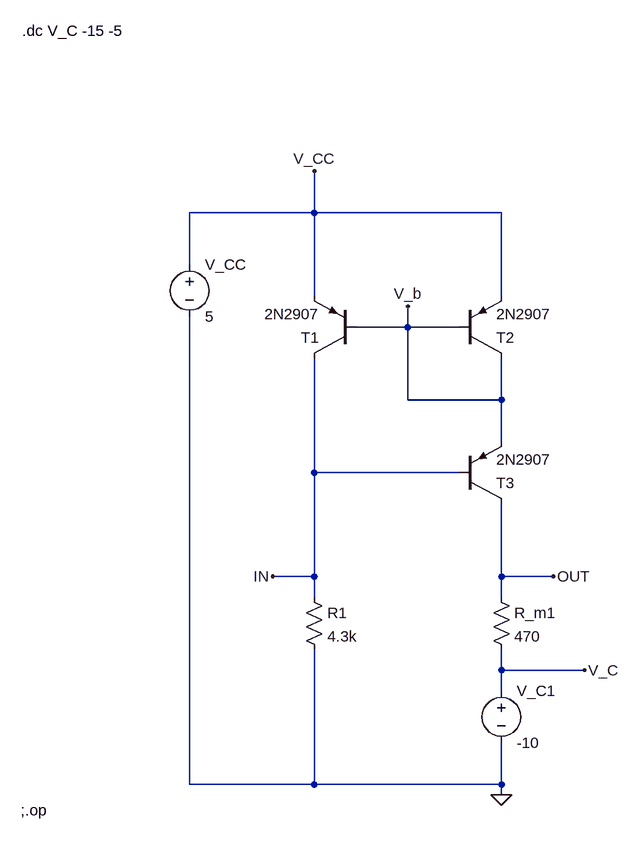
[diagram p0: schematic wilson_current_mirror.asc]
wilson_current_mirror.asc, the LTspice schematic file:
Version 4
SHEET 1 880 680
WIRE -912 -1040 -912 -1104
WIRE -912 -1040 -1104 -1040
WIRE -624 -1040 -912 -1040
WIRE -1104 -960 -1104 -1040
WIRE -912 -912 -912 -1040
WIRE -624 -912 -624 -1040
WIRE -768 -864 -768 -896
WIRE -768 -864 -848 -864
WIRE -688 -864 -768 -864
WIRE -768 -752 -768 -864
WIRE -624 -752 -624 -816
WIRE -624 -752 -768 -752
WIRE -624 -688 -624 -752
WIRE -912 -640 -912 -816
WIRE -688 -640 -912 -640
WIRE -912 -480 -912 -640
WIRE -912 -480 -976 -480
WIRE -624 -480 -624 -592
WIRE -544 -480 -624 -480
WIRE -912 -448 -912 -480
WIRE -624 -448 -624 -480
WIRE -624 -336 -624 -368
WIRE -496 -336 -624 -336
WIRE -624 -304 -624 -336
WIRE -1104 -160 -1104 -880
WIRE -912 -160 -912 -368
WIRE -912 -160 -1104 -160
WIRE -624 -160 -624 -224
WIRE -624 -160 -912 -160
WIRE -624 -144 -624 -160
FLAG -624 -144 0
FLAG -912 -1104 V_CC
FLAG -768 -896 V_b
FLAG -976 -480 IN
FLAG -544 -480 OUT
FLAG -496 -336 V_C
SYMBOL voltage -1104 -976 R0
WINDOW 123 0 0 Left 0
WINDOW 39 0 0 Left 0
SYMATTR InstName V_CC
SYMATTR Value 5
SYMBOL voltage -624 -320 R0
WINDOW 123 0 0 Left 0
WINDOW 39 0 0 Left 0
SYMATTR InstName V_C1
SYMATTR Value -10
SYMBOL pnp -848 -816 R180
SYMATTR InstName T1
SYMATTR Value 2N2907
SYMBOL pnp -688 -816 M180
SYMATTR InstName T2
SYMATTR Value 2N2907
SYMBOL res -928 -464 R0
SYMATTR InstName R1
SYMATTR Value 4.3k
SYMBOL res -640 -464 R0
SYMATTR InstName R_m1
SYMATTR Value 470
SYMBOL pnp -688 -592 M180
SYMATTR InstName T3
SYMATTR Value 2N2907
TEXT -1362 -1320 Left 2 !.dc V_C -15 -5
TEXT -1364 -120 Left 2 !;.op

The netlist it stands for:
* wilson_current_mirror.asc
V_CC V_CC 0 5
V_C1 V_C 0 -10
Q§T1 IN V_b V_CC 0 2N2907
Q§T2 V_b V_b V_CC 0 2N2907
R1 IN 0 4.3k
R_m1 OUT V_C 470
Q§T3 OUT IN V_b 0 2N2907
.model NPN NPN
.model PNP PNP
.lib standard.bjt
.dc V_C -15 -5
;.op
.backanno
.end